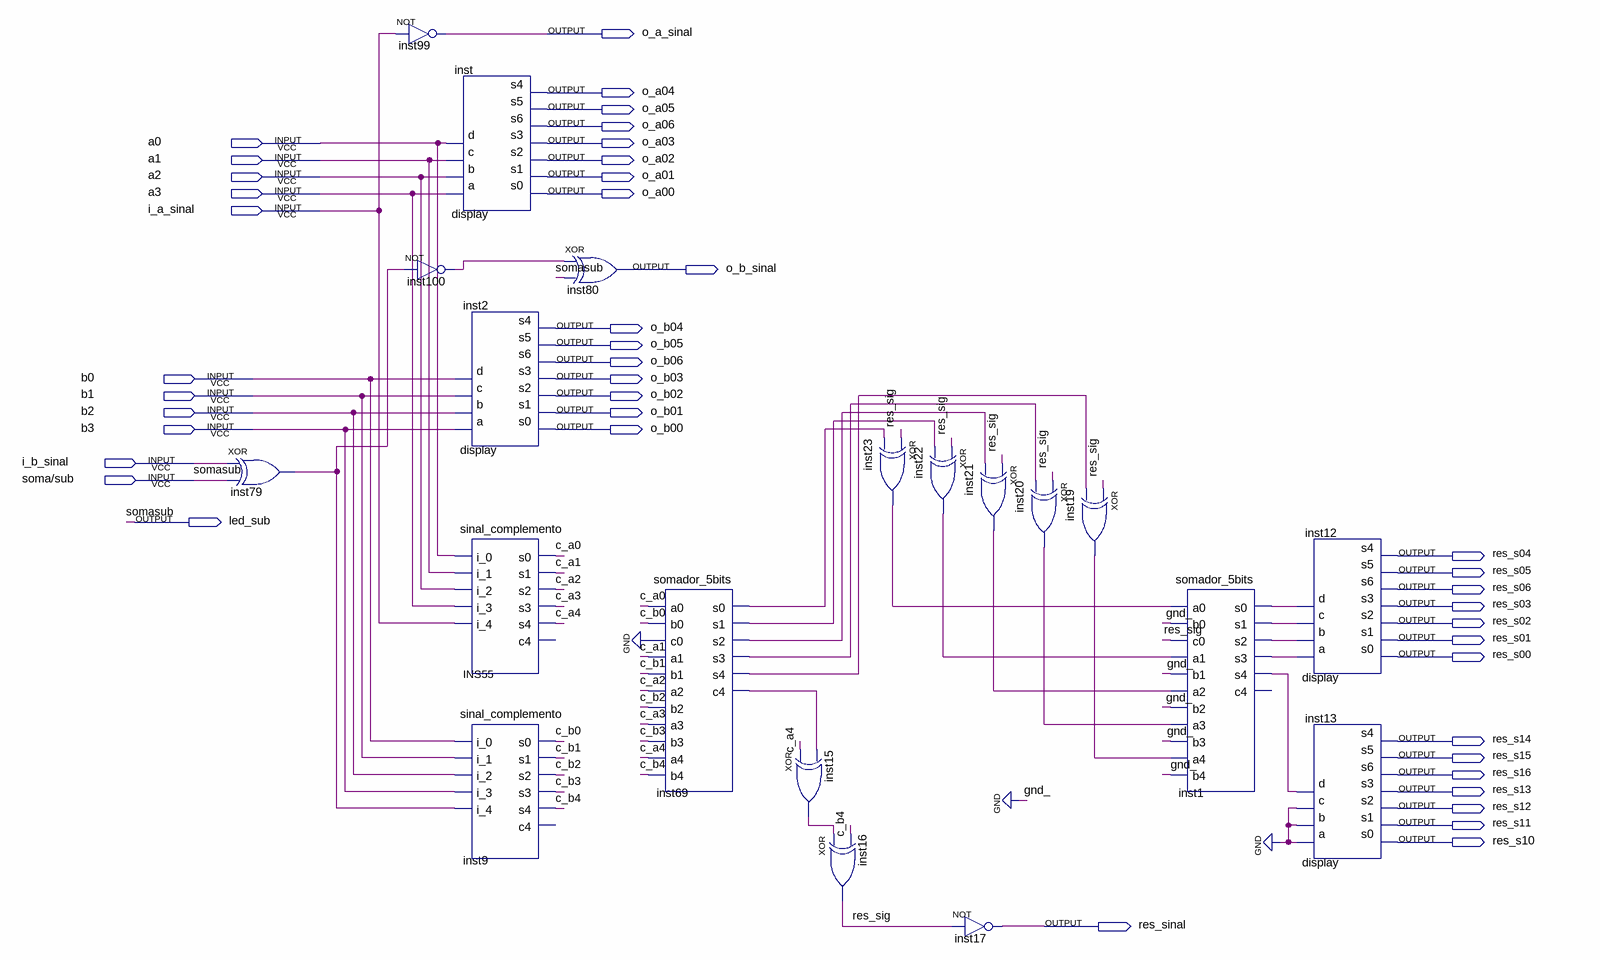
[diagram p0: schematic sheet]
// Quartus schematic aula09.bdf as structural Verilog: 20 symbols, 43 pins
module aula09 (
  input  a0,
  input  a1,
  input  a2,
  input  a3,
  input  i_a_sinal,
  input  b0,
  input  b1,
  input  b2,
  input  b3,
  input  i_b_sinal,
  input  \soma/sub ,
  output o_a_sinal,
  output o_a04,
  output o_a05,
  output o_a06,
  output o_a03,
  output o_a02,
  output o_a01,
  output o_a00,
  output o_b_sinal,
  output o_b04,
  output o_b05,
  output o_b06,
  output o_b03,
  output o_b02,
  output o_b01,
  output o_b00,
  output led_sub,
  output res_s04,
  output res_s05,
  output res_s06,
  output res_s03,
  output res_s02,
  output res_s01,
  output res_s00,
  output res_s14,
  output res_s15,
  output res_s16,
  output res_s13,
  output res_s12,
  output res_s11,
  output res_s10,
  output res_sinal
);

  wire c_a0, c_a1, c_a2, c_a3, c_a4, c_b0, c_b1, c_b2, c_b3, c_b4, inst1_s0, inst1_s1, inst1_s2, inst1_s3,
       inst1_s4, inst15_out, inst19_out, inst20_out, inst21_out, inst22_out, inst23_out, inst69_c4,
       inst69_s0, inst69_s1, inst69_s2, inst69_s3, inst69_s4, inst79_out, inst100_out, res_sig;

  xor inst79 (inst79_out, i_b_sinal, \soma/sub );
  not inst99 (o_a_sinal, i_a_sinal);
  not inst100 (inst100_out, inst79_out);
  display inst (
    .a(a3), .b(a2), .c(a1), .d(a0), .s0(o_a00), .s1(o_a01), .s2(o_a02), .s3(o_a03), .s6(o_a06), .s5(o_a05),
    .s4(o_a04));
  display inst2 (
    .a(b3), .b(b2), .c(b1), .d(b0), .s0(o_b00), .s1(o_b01), .s2(o_b02), .s3(o_b03), .s6(o_b06), .s5(o_b05),
    .s4(o_b04));
  sinal_complemento INS55 (
    .i_0(a0), .i_1(a1), .i_2(a2), .i_3(a3), .i_4(i_a_sinal), .s0(c_a0), .s1(c_a1), .s2(c_a2), .s3(c_a3),
    .s4(c_a4));  // open: c4
  sinal_complemento inst9 (
    .i_0(b0), .i_1(b1), .i_2(b2), .i_3(b3), .i_4(inst79_out), .s0(c_b0), .s1(c_b1), .s2(c_b2), .s3(c_b3),
    .s4(c_b4));  // open: c4
  xor inst80 (o_b_sinal, inst100_out, \soma/sub );
  somador_5bits inst69 (
    .a0(c_a0), .b0(c_b0), .c0(1'b0), .a1(c_a1), .b1(c_b1), .a2(c_a2), .b2(c_b2), .a3(c_a3), .b3(c_b3),
    .a4(c_a4), .b4(c_b4), .s0(inst69_s0), .s1(inst69_s1), .s2(inst69_s2), .s3(inst69_s3), .s4(inst69_s4),
    .c4(inst69_c4));
  xor inst15 (inst15_out, c_a4, inst69_c4);
  xor inst16 (res_sig, inst15_out, c_b4);
  xor inst23 (inst23_out, res_sig, inst69_s0);
  xor inst22 (inst22_out, res_sig, inst69_s1);
  not inst17 (res_sinal, res_sig);
  xor inst21 (inst21_out, res_sig, inst69_s2);
  xor inst20 (inst20_out, res_sig, inst69_s3);
  xor inst19 (inst19_out, res_sig, inst69_s4);
  somador_5bits inst1 (
    .a0(inst23_out), .b0(1'b0), .c0(res_sig), .a1(inst22_out), .b1(1'b0), .a2(inst21_out), .b2(1'b0),
    .a3(inst20_out), .b3(1'b0), .a4(inst19_out), .b4(1'b0), .s0(inst1_s0), .s1(inst1_s1), .s2(inst1_s2),
    .s3(inst1_s3), .s4(inst1_s4));  // open: c4
  display inst12 (
    .a(inst1_s3), .b(inst1_s2), .c(inst1_s1), .d(inst1_s0), .s0(res_s00), .s1(res_s01), .s2(res_s02),
    .s3(res_s03), .s6(res_s06), .s5(res_s05), .s4(res_s04));
  display inst13 (
    .a(1'b0), .b(1'b0), .c(1'b0), .d(inst1_s4), .s0(res_s10), .s1(res_s11), .s2(res_s12), .s3(res_s13),
    .s6(res_s16), .s5(res_s15), .s4(res_s14));

  assign led_sub = \soma/sub ;

  // Other names for the same wires on the sheet: somasub = \soma/sub 
endmodule
